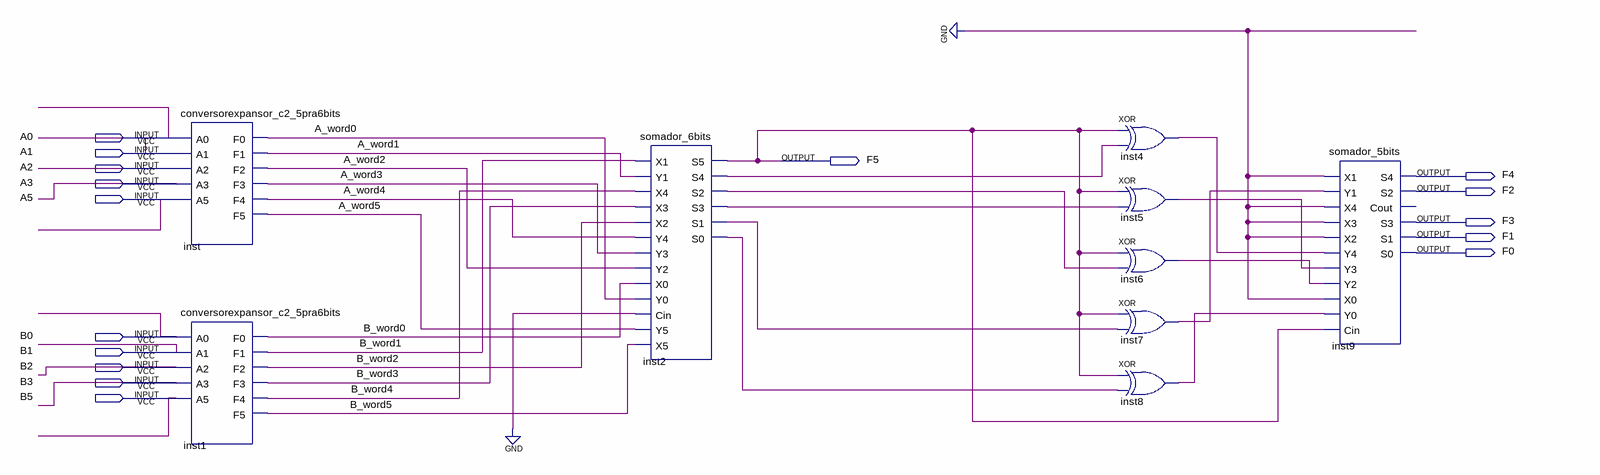
[diagram p0: schematic sheet]
// Quartus schematic somador_ula_completo.bdf as structural Verilog: 9 symbols, 16 pins
module somador_ula_completo (
  input  A0,
  input  A1,
  input  A2,
  input  A3,
  input  A5,
  input  B0,
  input  B1,
  input  B2,
  input  B3,
  input  B5,
  output F5,
  output F4,
  output F2,
  output F3,
  output F1,
  output F0
);

  wire A_word0, A_word1, A_word2, A_word3, A_word4, A_word5, B_word0, B_word1, B_word2, B_word3, B_word4,
       B_word5, inst2_s0, inst2_s1, inst2_s2, inst2_s3, inst2_s4, inst4_out, inst5_out, inst6_out, inst7_out,
       inst8_out;

  conversorexpansor_c2_5pra6bits inst (
    .A0(A0), .A1(A1), .A2(A2), .A3(A3), .A5(A5), .F0(A_word0), .F1(A_word1), .F2(A_word2), .F3(A_word3),
    .F4(A_word4), .F5(A_word5));
  conversorexpansor_c2_5pra6bits inst1 (
    .A0(B0), .A1(B1), .A2(B2), .A3(B3), .A5(B5), .F0(B_word0), .F1(B_word1), .F2(B_word2), .F3(B_word3),
    .F4(B_word4), .F5(B_word5));
  somador_6bits inst2 (
    .X1(B_word1), .Y1(A_word1), .X4(B_word4), .X3(B_word3), .X2(B_word2), .Y4(A_word4), .Y3(A_word3),
    .Y2(A_word2), .X0(B_word0), .Y0(A_word0), .Cin(1'b0), .Y5(A_word5), .X5(B_word5), .S5(F5), .S4(inst2_s4),
    .S2(inst2_s2), .S3(inst2_s3), .S1(inst2_s1), .S0(inst2_s0));
  xor inst4 (inst4_out, F5, inst2_s4);
  xor inst5 (inst5_out, F5, inst2_s3);
  xor inst6 (inst6_out, F5, inst2_s2);
  xor inst7 (inst7_out, F5, inst2_s1);
  xor inst8 (inst8_out, F5, inst2_s0);
  somador_5bits inst9 (
    .X1(1'b0), .Y1(inst7_out), .X4(1'b0), .X3(1'b0), .X2(1'b0), .Y4(inst4_out), .Y3(inst5_out),
    .Y2(inst6_out), .X0(1'b0), .Y0(inst8_out), .Cin(F5), .S4(F4), .S2(F2), .S3(F3), .S1(F1), .S0(F0));  // open: Cout
endmodule
